# EAGLE design Mainboard (EAGLE 7.5.0)
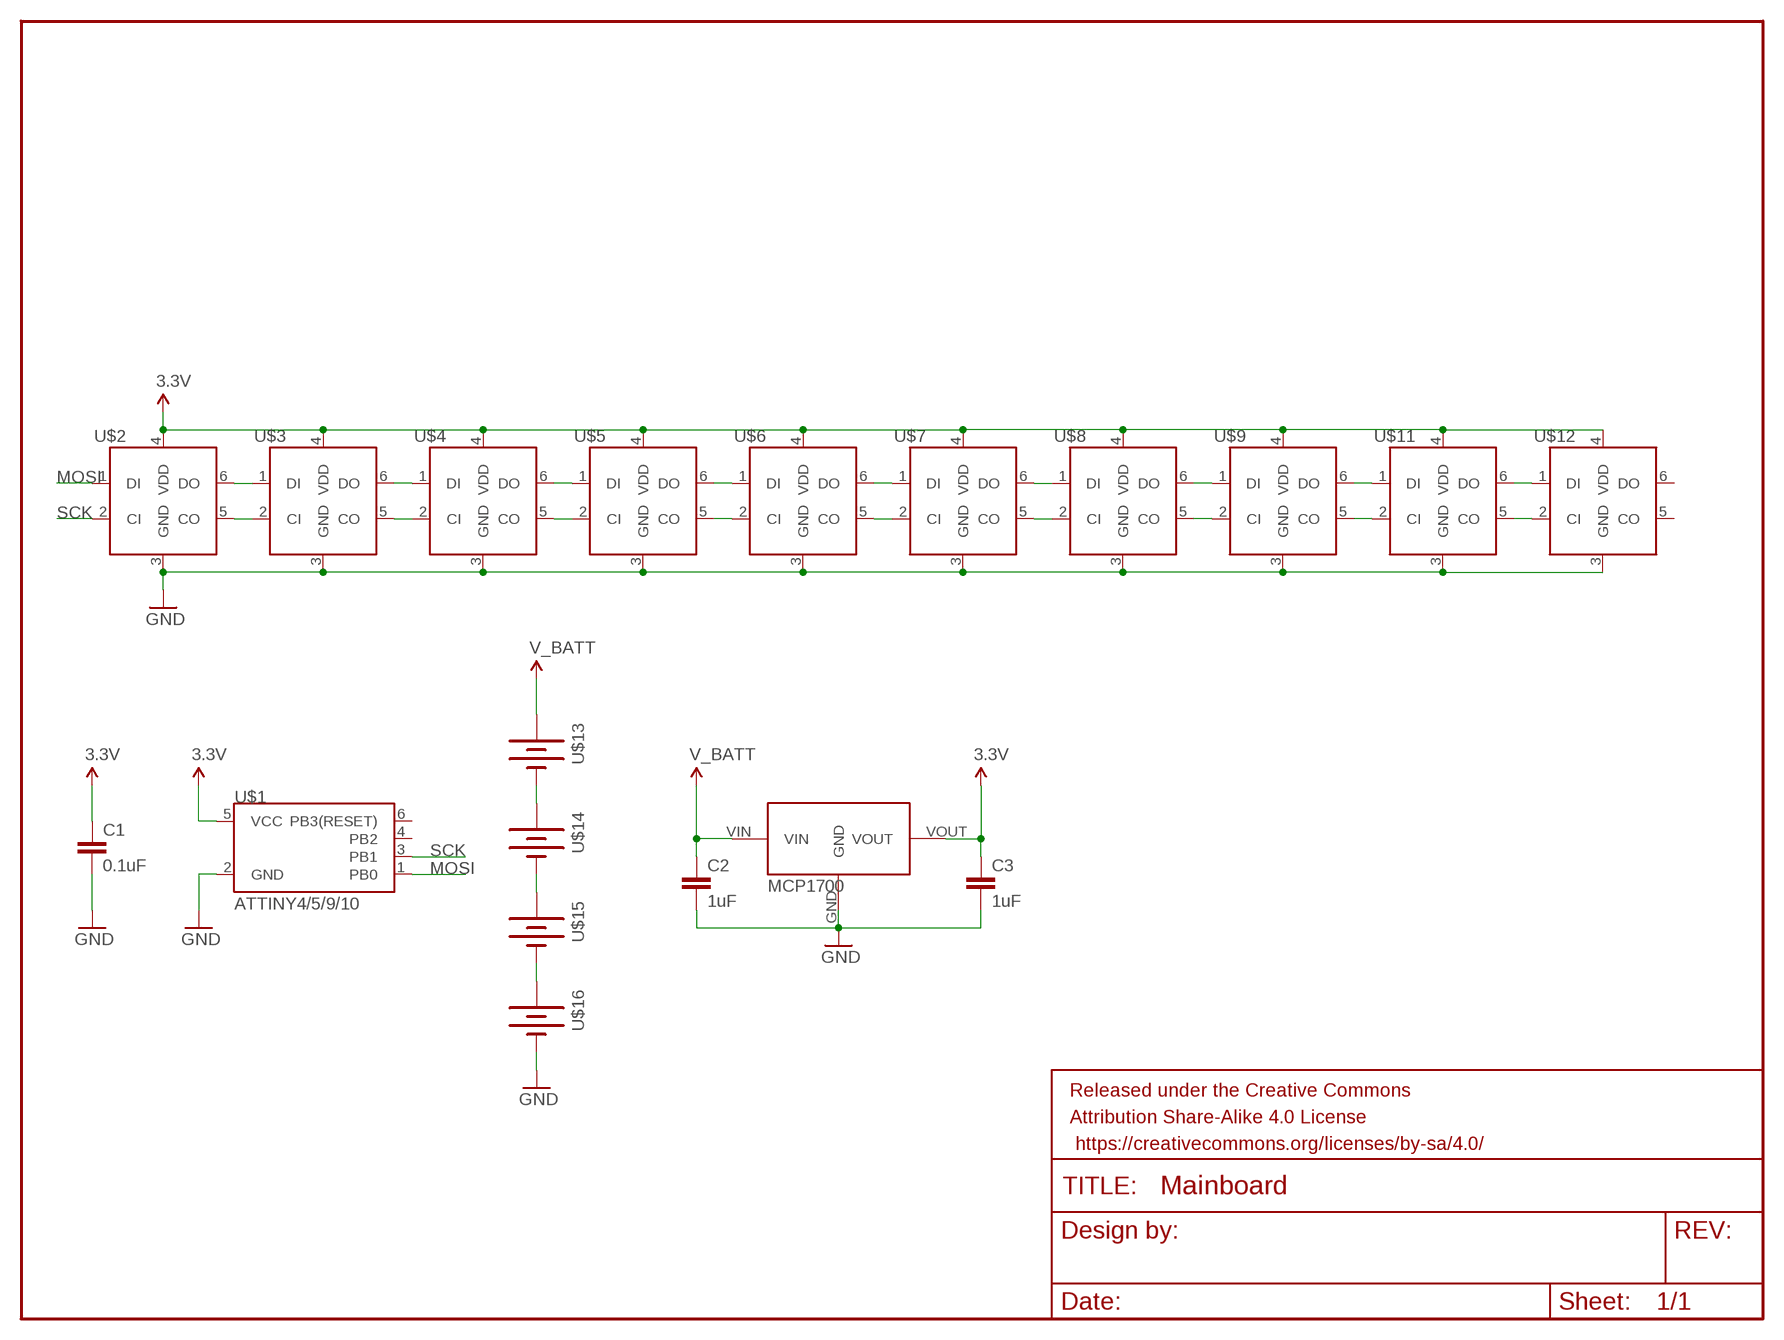
[diagram p0: schematic, sheet 1]

## Parts
C1  0.1uF  CAP0402-CAP  [0402-CAP]
C2  1uF  CAP0402-CAP  [0402-CAP]
C3  1uF  CAP0402-CAP  [0402-CAP]
FRAME1  FRAME-LETTER  [CREATIVE_COMMONS]
U$1  ATTINY4/5/9/10  [SOT23-6]
U$2  APA102C  [LED-TRICOLOR-5050-IC]
U$3  APA102C  [LED-TRICOLOR-5050-IC]
U$4  APA102C  [LED-TRICOLOR-5050-IC]
U$5  APA102C  [LED-TRICOLOR-5050-IC]
U$6  APA102C  [LED-TRICOLOR-5050-IC]
U$7  APA102C  [LED-TRICOLOR-5050-IC]
U$8  APA102C  [LED-TRICOLOR-5050-IC]
U$9  APA102C  [LED-TRICOLOR-5050-IC]
U$11  APA102C  [LED-TRICOLOR-5050-IC]
U$12  APA102C  [LED-TRICOLOR-5050-IC]
U$13  AAAA-BATTERYS  [KEYSTONE-SMD-AAAA-CLIPS]
U$14  AAAA-BATTERYS  [KEYSTONE-SMD-AAAA-CLIPS]
U$15  AAAA-BATTERYS  [KEYSTONE-SMD-AAAA-CLIPS]
U$16  AAAA-BATTERYS  [KEYSTONE-SMD-AAAA-CLIPS]
U$17  MCP1700  [MCP1700]

## Nets
3.3V: C1.1 C3.1 U$1.5(VCC) U$2.4(VDD) U$3.4(VDD) U$4.4(VDD) U$5.4(VDD) U$6.4(VDD) U$7.4(VDD) U$8.4(VDD) U$9.4(VDD) U$11.4(VDD) U$12.4(VDD) U$17.VOUT
GND: C1.2 C2.2 C3.2 U$1.2(GND) U$2.3(GND) U$3.3(GND) U$4.3(GND) U$5.3(GND) U$6.3(GND) U$7.3(GND) U$8.3(GND) U$9.3(GND) U$11.3(GND) U$12.3(GND) U$16.P$2(-) U$17.GND
MOSI: U$1.1(PB0) U$2.1(DI)
N$1: U$2.6(DO) U$3.1(DI)
N$2: U$2.5(CO) U$3.2(CI)
N$3: U$3.5(CO) U$4.2(CI)
N$4: U$4.5(CO) U$5.2(CI)
N$5: U$5.5(CO) U$6.2(CI)
N$6: U$13.P$2(-) U$14.P$1(+)
N$8: U$6.5(CO) U$7.2(CI)
N$9: U$6.6(DO) U$7.1(DI)
N$10: U$5.6(DO) U$6.1(DI)
N$11: U$4.6(DO) U$5.1(DI)
N$12: U$3.6(DO) U$4.1(DI)
N$13: U$7.6(DO) U$8.1(DI)
N$14: U$7.5(CO) U$8.2(CI)
N$15: U$8.6(DO) U$9.1(DI)
N$16: U$8.5(CO) U$9.2(CI)
N$17: U$9.6(DO) U$11.1(DI)
N$18: U$9.5(CO) U$11.2(CI)
N$19: U$11.6(DO) U$12.1(DI)
N$20: U$11.5(CO) U$12.2(CI)
N$23: U$14.P$2(-) U$15.P$1(+)
N$24: U$15.P$2(-) U$16.P$1(+)
SCK: U$1.3(PB1) U$2.2(CI)
V_BATT: C2.1 U$13.P$1(+) U$17.VIN
Unconnected: U$1.4(PB2) U$1.6(PB3(RESET)) U$12.5(CO) U$12.6(DO)

## Library data of the parts
C1-C3 = SparkFun-Passives:CAP: Capacitor Standard 0603 ceramic capacitor, and 0.1" leaded capacitor.
FRAME1 = SparkFun-Aesthetics:FRAME-LETTER: Schematic Frame Standard 8.5x11 US Letter frame
U$1 = OpenSourceArt_Eagle_Library:ATTINY4/5/9/10
U$2-U$9 U$11 U$12 = OpenSourceArt_Eagle_Library:APA102C: APA102C 5050 LED http://www.digikey.com/product-detail/en/1655/1528-1104-ND/5154679
U$13-U$16 = OpenSourceArt_Eagle_Library:AAAA-BATTERY
U$17 = OpenSourceArt_Eagle_Library:MCP1700: Microchip LDO "MCP1700" in a 3-Pin SOT-23 package. ID: MCP1700T-3302E/TT

## Board
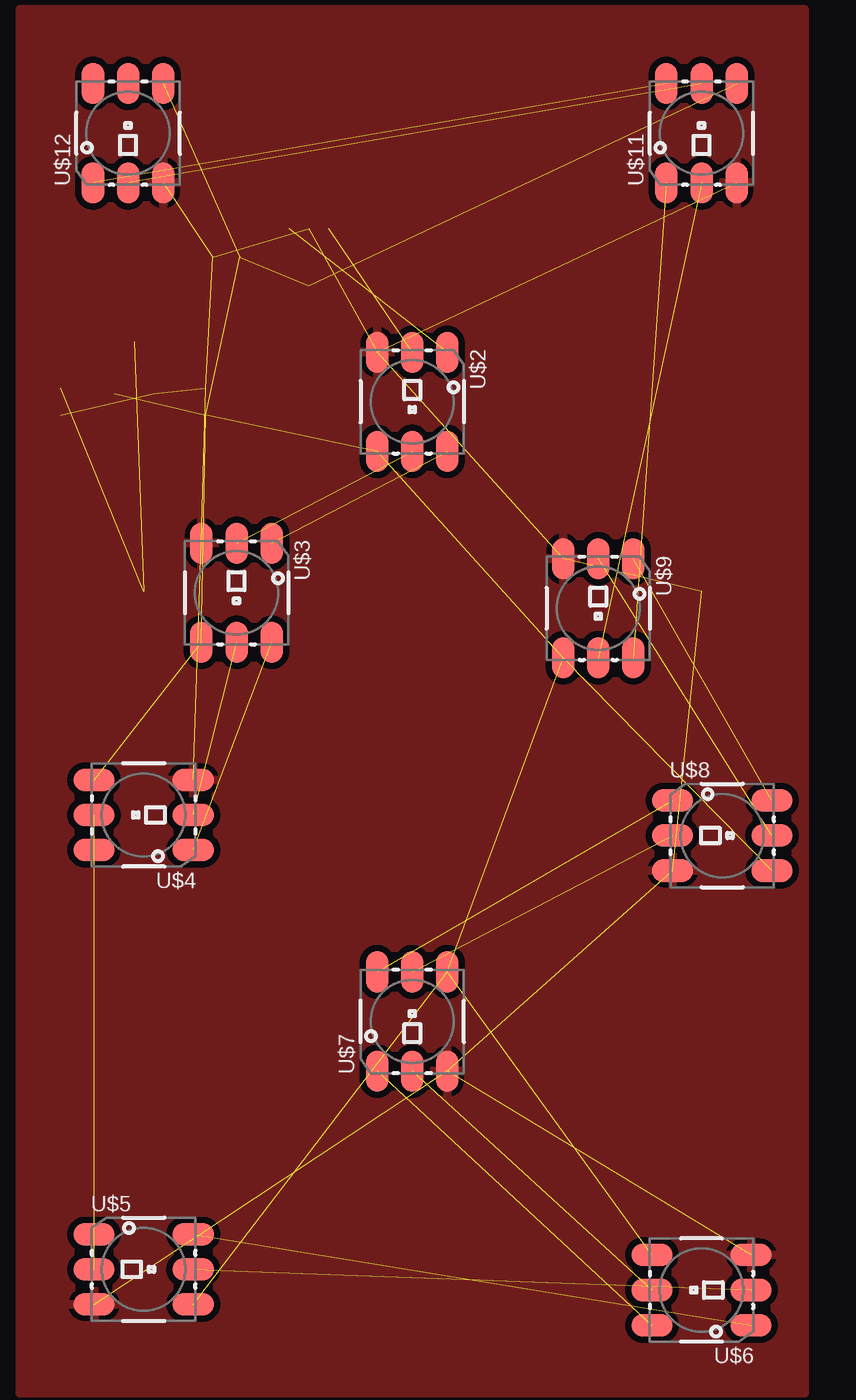
[diagram p1: board, top side]
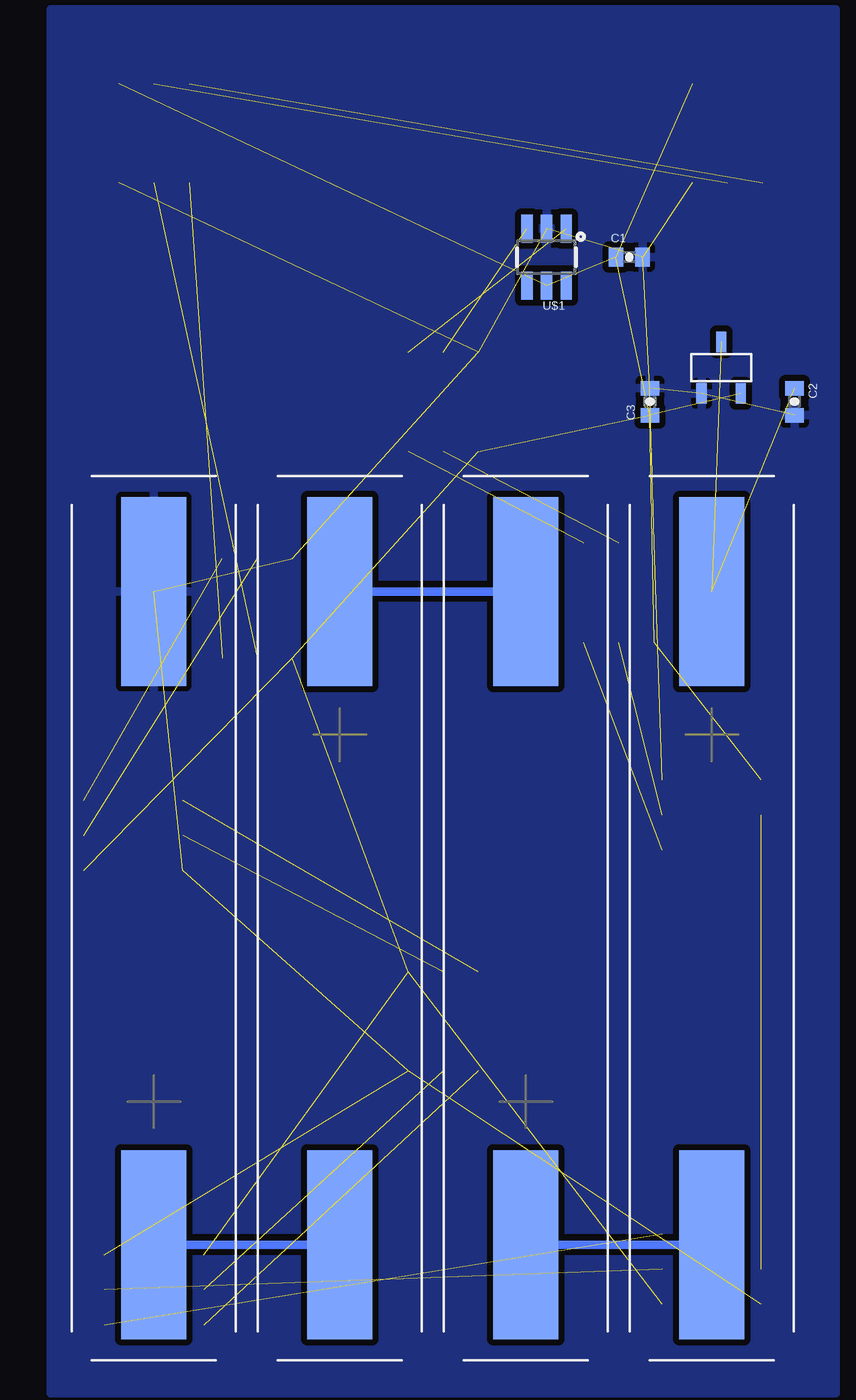
[diagram p2: board, bottom side, seen from below]

No outline drawn. Coordinates in mm, seen from the top.
Copper layers (1*16): Top 0.035mm / dielectric 1.5mm / Bottom 0.035mm
Design rules "SparkFun": minimum track width 8mil, minimum drill 20mil, track to track 8mil, track to pad 8mil, pad to pad 8mil, via to via 8mil, smd to smd 8mil, copper to edge 10mil, drill to drill 8mil, minimum pad ring 12mil, minimum via ring 10mil, stop-mask expansion 4mil, vias tented up to drill 25mil, thermal gap 10mil

### Footprints (pad centres in the part's own frame; a part is rotated, then mirrored left to right if it is on the bottom)
0402-CAP = smd 0.7 x 0.9: 1 -0.65,0; 2 0.65,0
SOT23-6 = smd 0.55 x 1.35: 1 -0.95,-1.375; 2 0,-1.375; 3 0.95,-1.375; 4 0.95,1.375; 5 0,1.375; 6 -0.95,1.375
LED-TRICOLOR-5050-IC = smd 2 x 1.1: 1 -2.4,1.7; 2 -2.4,0; 3 -2.4,-1.7; 4 2.4,-1.7; 5 2.4,0; 6 2.4,1.7
KEYSTONE-SMD-AAAA-CLIPS = smd 9.14 x 3.15: P$1 -15.81,0; P$2 15.81,0
MCP1700 = smd 0.5 x 1: GND 0.5,-0.6; VIN 1.45,1.9; VOUT 2.4,-0.6

### Placement (x,y rotation side)
C1  10,55 0 bottom
C2  2,48 270 bottom
C3  9,48 90 bottom
FRAME1  21,-8 0 top
U$1  14,55 180 bottom
U$2  19,48 270 top
U$3  10.5,38.75 270 top
U$4  6,28 180 top
U$5  6,6 0 top
U$6  33,5 180 top
U$7  19,18 90 top
U$8  34,27 0 top
U$9  28,38 270 top
U$11  33,61 90 top
U$12  5.25,61 90 top
U$13  6,23 270 bottom
U$14  15,23 90 bottom
U$15  24,23 270 bottom
U$16  33,23 90 bottom
U$17  7,49 0 bottom

### Tracks (layer width: path | path; a pad name or v marks a point on that pad's centre or on a via)
3.3V  (13 unrouted)
GND  (15 unrouted)
  pour Top (isolate 0.305): 0,67 0,0 38,0 38,67
  pour Bottom (isolate 0.305): 0,67 38,67 38,0 0,0
MOSI  (1 unrouted)
N$1  (1 unrouted)
N$2  (1 unrouted)
N$3  (1 unrouted)
N$4  (1 unrouted)
N$5  (1 unrouted)
N$6
  Bottom 0.406: U$13.P$2 U$14.P$1
N$8  (1 unrouted)
N$9  (1 unrouted)
N$10  (1 unrouted)
N$11  (1 unrouted)
N$12  (1 unrouted)
N$13  (1 unrouted)
N$14  (1 unrouted)
N$15  (1 unrouted)
N$16  (1 unrouted)
N$17  (1 unrouted)
N$18  (1 unrouted)
N$19  (1 unrouted)
N$20  (1 unrouted)
N$23
  Bottom 0.406: U$14.P$2 U$15.P$1
N$24
  Bottom 0.406: U$15.P$2 U$16.P$1
SCK  (1 unrouted)
V_BATT  (2 unrouted)